# EasyEDA schematic output_charlieplex_12x11.json
TITLE: Sheet_1; REV: 1.0; Date: 2025-10-31; Sheet: 1/1; Drawn By: robdobsn; Company: Your Company
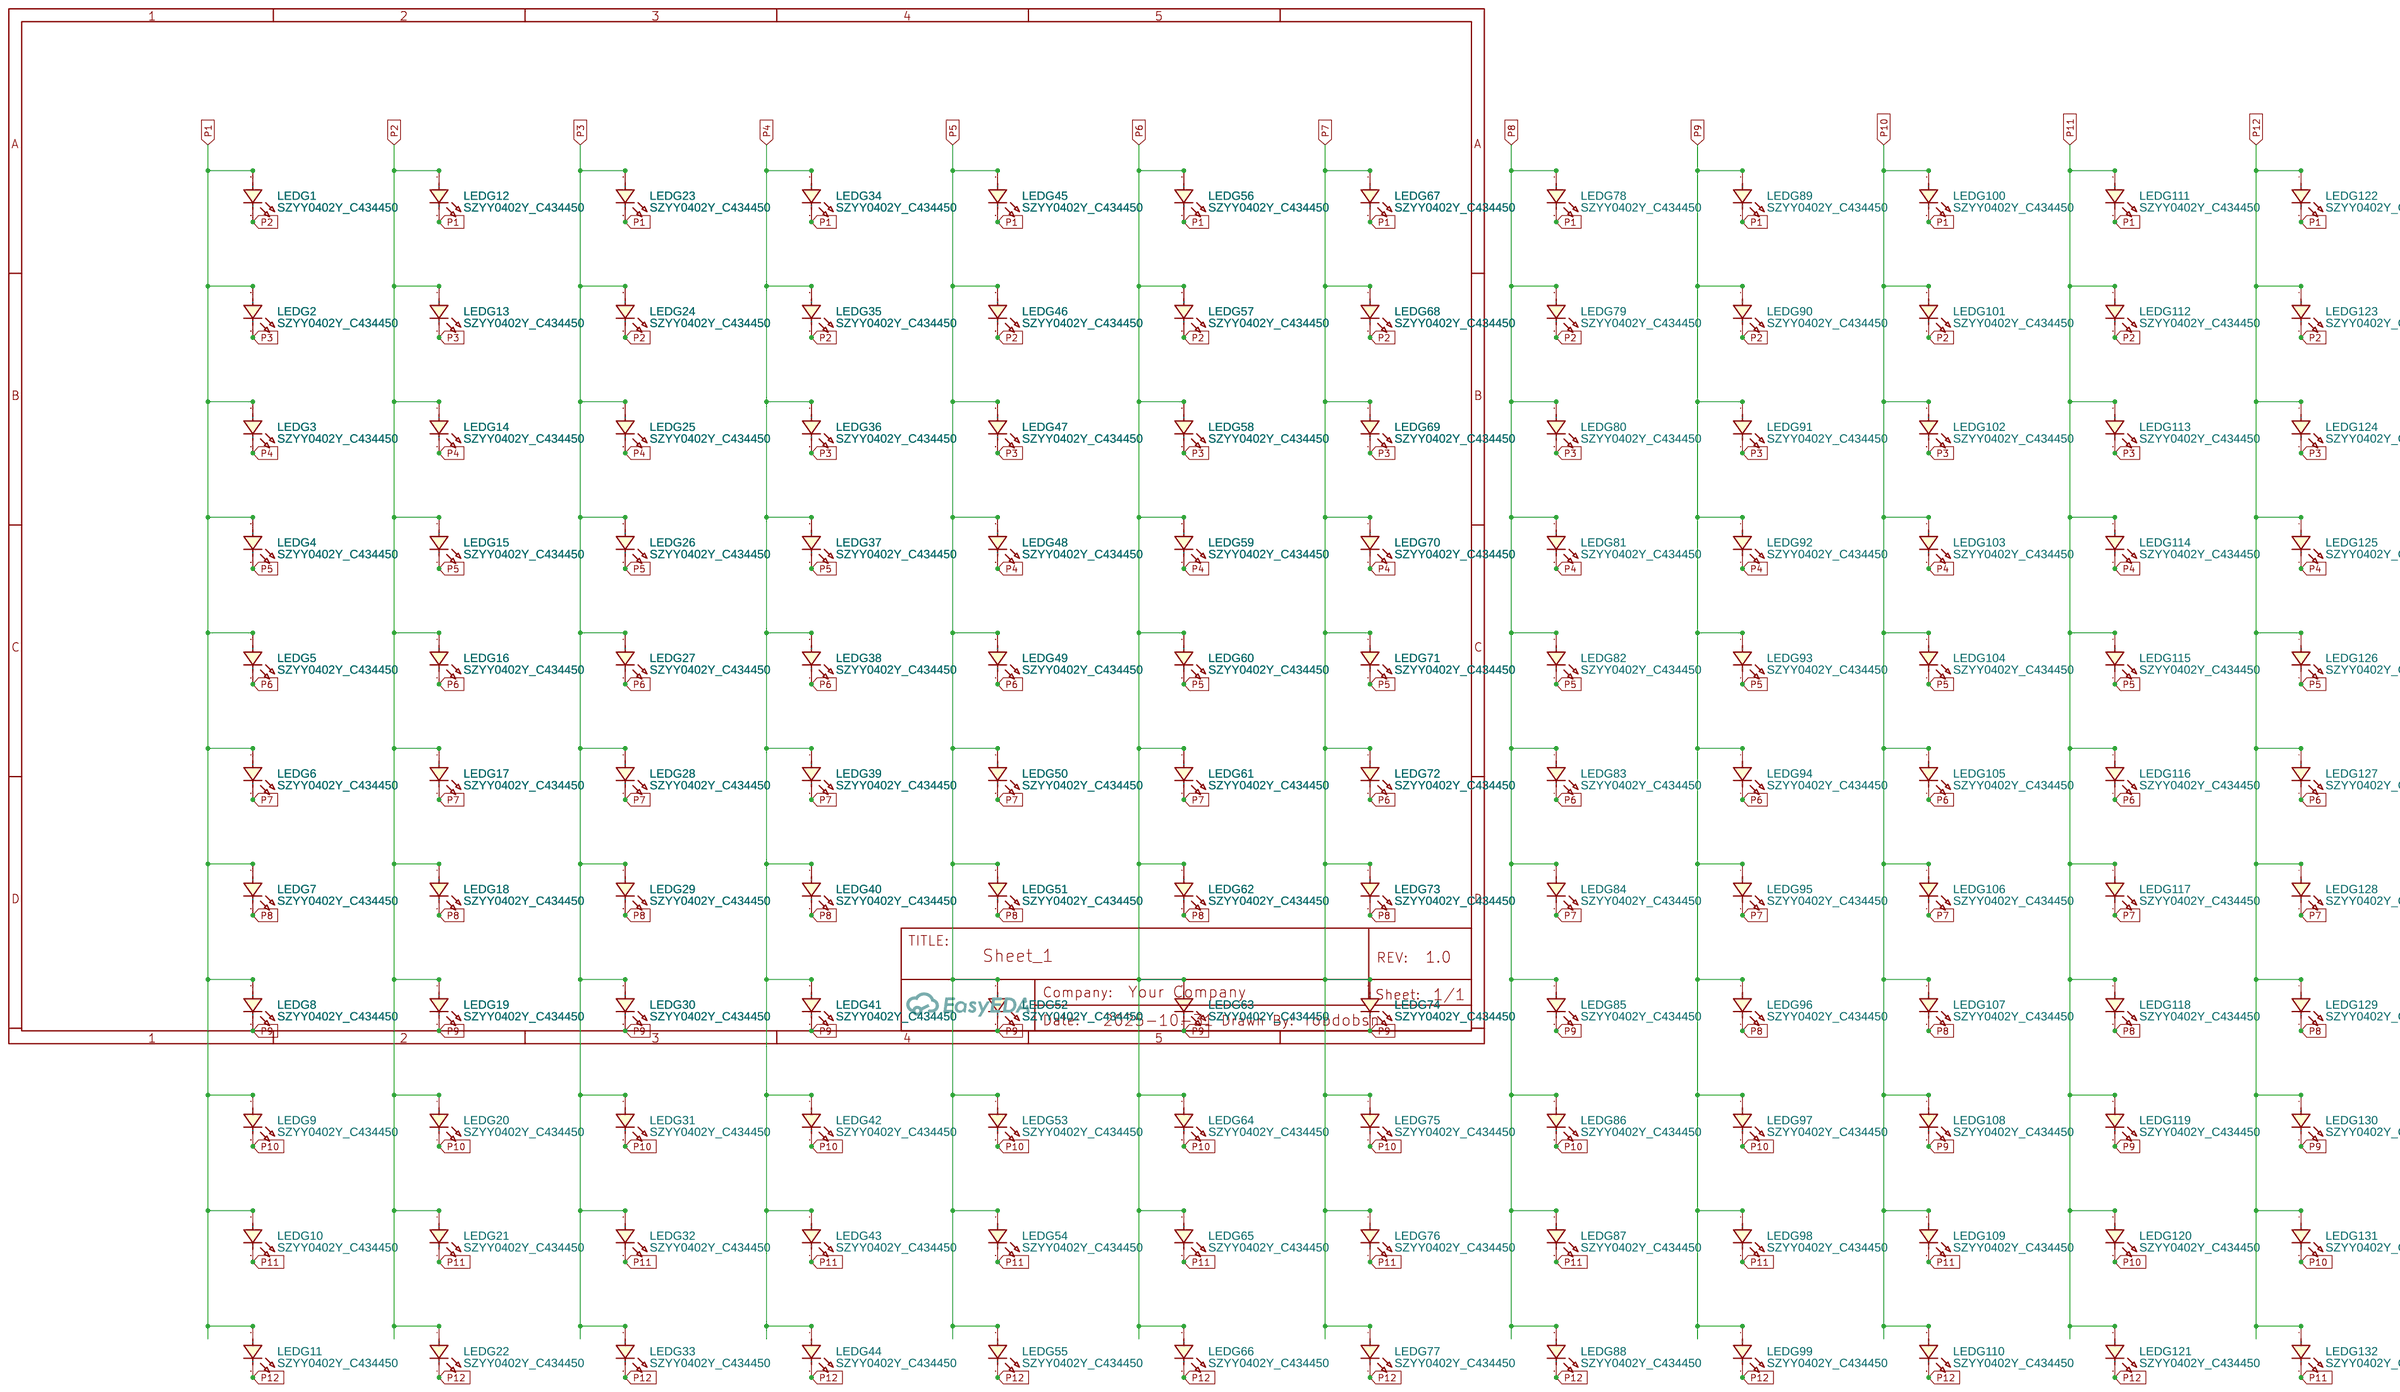
[diagram p0: schematic sheet]

## Parts
LEDG1  SZYY0402Y_C434450  [LED0402-FD_YELLOW]
LEDG2  SZYY0402Y_C434450  [LED0402-FD_YELLOW]
LEDG3  SZYY0402Y_C434450  [LED0402-FD_YELLOW]
LEDG4  SZYY0402Y_C434450  [LED0402-FD_YELLOW]
LEDG5  SZYY0402Y_C434450  [LED0402-FD_YELLOW]
LEDG6  SZYY0402Y_C434450  [LED0402-FD_YELLOW]
LEDG7  SZYY0402Y_C434450  [LED0402-FD_YELLOW]
LEDG8  SZYY0402Y_C434450  [LED0402-FD_YELLOW]
LEDG9  SZYY0402Y_C434450  [LED0402-FD_YELLOW]
LEDG10  SZYY0402Y_C434450  [LED0402-FD_YELLOW]
LEDG11  SZYY0402Y_C434450  [LED0402-FD_YELLOW]
LEDG12  SZYY0402Y_C434450  [LED0402-FD_YELLOW]
LEDG13  SZYY0402Y_C434450  [LED0402-FD_YELLOW]
LEDG14  SZYY0402Y_C434450  [LED0402-FD_YELLOW]
LEDG15  SZYY0402Y_C434450  [LED0402-FD_YELLOW]
LEDG16  SZYY0402Y_C434450  [LED0402-FD_YELLOW]
LEDG17  SZYY0402Y_C434450  [LED0402-FD_YELLOW]
LEDG18  SZYY0402Y_C434450  [LED0402-FD_YELLOW]
LEDG19  SZYY0402Y_C434450  [LED0402-FD_YELLOW]
LEDG20  SZYY0402Y_C434450  [LED0402-FD_YELLOW]
LEDG21  SZYY0402Y_C434450  [LED0402-FD_YELLOW]
LEDG22  SZYY0402Y_C434450  [LED0402-FD_YELLOW]
LEDG23  SZYY0402Y_C434450  [LED0402-FD_YELLOW]
LEDG24  SZYY0402Y_C434450  [LED0402-FD_YELLOW]
LEDG25  SZYY0402Y_C434450  [LED0402-FD_YELLOW]
LEDG26  SZYY0402Y_C434450  [LED0402-FD_YELLOW]
LEDG27  SZYY0402Y_C434450  [LED0402-FD_YELLOW]
LEDG28  SZYY0402Y_C434450  [LED0402-FD_YELLOW]
LEDG29  SZYY0402Y_C434450  [LED0402-FD_YELLOW]
LEDG30  SZYY0402Y_C434450  [LED0402-FD_YELLOW]
LEDG31  SZYY0402Y_C434450  [LED0402-FD_YELLOW]
LEDG32  SZYY0402Y_C434450  [LED0402-FD_YELLOW]
LEDG33  SZYY0402Y_C434450  [LED0402-FD_YELLOW]
LEDG34  SZYY0402Y_C434450  [LED0402-FD_YELLOW]
LEDG35  SZYY0402Y_C434450  [LED0402-FD_YELLOW]
LEDG36  SZYY0402Y_C434450  [LED0402-FD_YELLOW]
LEDG37  SZYY0402Y_C434450  [LED0402-FD_YELLOW]
LEDG38  SZYY0402Y_C434450  [LED0402-FD_YELLOW]
LEDG39  SZYY0402Y_C434450  [LED0402-FD_YELLOW]
LEDG40  SZYY0402Y_C434450  [LED0402-FD_YELLOW]
LEDG41  SZYY0402Y_C434450  [LED0402-FD_YELLOW]
LEDG42  SZYY0402Y_C434450  [LED0402-FD_YELLOW]
LEDG43  SZYY0402Y_C434450  [LED0402-FD_YELLOW]
LEDG44  SZYY0402Y_C434450  [LED0402-FD_YELLOW]
LEDG45  SZYY0402Y_C434450  [LED0402-FD_YELLOW]
LEDG46  SZYY0402Y_C434450  [LED0402-FD_YELLOW]
LEDG47  SZYY0402Y_C434450  [LED0402-FD_YELLOW]
LEDG48  SZYY0402Y_C434450  [LED0402-FD_YELLOW]
LEDG49  SZYY0402Y_C434450  [LED0402-FD_YELLOW]
LEDG50  SZYY0402Y_C434450  [LED0402-FD_YELLOW]
LEDG51  SZYY0402Y_C434450  [LED0402-FD_YELLOW]
LEDG52  SZYY0402Y_C434450  [LED0402-FD_YELLOW]
LEDG53  SZYY0402Y_C434450  [LED0402-FD_YELLOW]
LEDG54  SZYY0402Y_C434450  [LED0402-FD_YELLOW]
LEDG55  SZYY0402Y_C434450  [LED0402-FD_YELLOW]
LEDG56  SZYY0402Y_C434450  [LED0402-FD_YELLOW]
LEDG57  SZYY0402Y_C434450  [LED0402-FD_YELLOW]
LEDG58  SZYY0402Y_C434450  [LED0402-FD_YELLOW]
LEDG59  SZYY0402Y_C434450  [LED0402-FD_YELLOW]
LEDG60  SZYY0402Y_C434450  [LED0402-FD_YELLOW]
LEDG61  SZYY0402Y_C434450  [LED0402-FD_YELLOW]
LEDG62  SZYY0402Y_C434450  [LED0402-FD_YELLOW]
LEDG63  SZYY0402Y_C434450  [LED0402-FD_YELLOW]
LEDG64  SZYY0402Y_C434450  [LED0402-FD_YELLOW]
LEDG65  SZYY0402Y_C434450  [LED0402-FD_YELLOW]
LEDG66  SZYY0402Y_C434450  [LED0402-FD_YELLOW]
LEDG67  SZYY0402Y_C434450  [LED0402-FD_YELLOW]
LEDG68  SZYY0402Y_C434450  [LED0402-FD_YELLOW]
LEDG69  SZYY0402Y_C434450  [LED0402-FD_YELLOW]
LEDG70  SZYY0402Y_C434450  [LED0402-FD_YELLOW]
LEDG71  SZYY0402Y_C434450  [LED0402-FD_YELLOW]
LEDG72  SZYY0402Y_C434450  [LED0402-FD_YELLOW]
LEDG73  SZYY0402Y_C434450  [LED0402-FD_YELLOW]
LEDG74  SZYY0402Y_C434450  [LED0402-FD_YELLOW]
LEDG75  SZYY0402Y_C434450  [LED0402-FD_YELLOW]
LEDG76  SZYY0402Y_C434450  [LED0402-FD_YELLOW]
LEDG77  SZYY0402Y_C434450  [LED0402-FD_YELLOW]
LEDG78  SZYY0402Y_C434450  [LED0402-FD_YELLOW]
LEDG79  SZYY0402Y_C434450  [LED0402-FD_YELLOW]
LEDG80  SZYY0402Y_C434450  [LED0402-FD_YELLOW]
LEDG81  SZYY0402Y_C434450  [LED0402-FD_YELLOW]
LEDG82  SZYY0402Y_C434450  [LED0402-FD_YELLOW]
LEDG83  SZYY0402Y_C434450  [LED0402-FD_YELLOW]
LEDG84  SZYY0402Y_C434450  [LED0402-FD_YELLOW]
LEDG85  SZYY0402Y_C434450  [LED0402-FD_YELLOW]
LEDG86  SZYY0402Y_C434450  [LED0402-FD_YELLOW]
LEDG87  SZYY0402Y_C434450  [LED0402-FD_YELLOW]
LEDG88  SZYY0402Y_C434450  [LED0402-FD_YELLOW]
LEDG89  SZYY0402Y_C434450  [LED0402-FD_YELLOW]
LEDG90  SZYY0402Y_C434450  [LED0402-FD_YELLOW]
LEDG91  SZYY0402Y_C434450  [LED0402-FD_YELLOW]
LEDG92  SZYY0402Y_C434450  [LED0402-FD_YELLOW]
LEDG93  SZYY0402Y_C434450  [LED0402-FD_YELLOW]
LEDG94  SZYY0402Y_C434450  [LED0402-FD_YELLOW]
LEDG95  SZYY0402Y_C434450  [LED0402-FD_YELLOW]
LEDG96  SZYY0402Y_C434450  [LED0402-FD_YELLOW]
LEDG97  SZYY0402Y_C434450  [LED0402-FD_YELLOW]
LEDG98  SZYY0402Y_C434450  [LED0402-FD_YELLOW]
LEDG99  SZYY0402Y_C434450  [LED0402-FD_YELLOW]
LEDG100  SZYY0402Y_C434450  [LED0402-FD_YELLOW]
LEDG101  SZYY0402Y_C434450  [LED0402-FD_YELLOW]
LEDG102  SZYY0402Y_C434450  [LED0402-FD_YELLOW]
LEDG103  SZYY0402Y_C434450  [LED0402-FD_YELLOW]
LEDG104  SZYY0402Y_C434450  [LED0402-FD_YELLOW]
LEDG105  SZYY0402Y_C434450  [LED0402-FD_YELLOW]
LEDG106  SZYY0402Y_C434450  [LED0402-FD_YELLOW]
LEDG107  SZYY0402Y_C434450  [LED0402-FD_YELLOW]
LEDG108  SZYY0402Y_C434450  [LED0402-FD_YELLOW]
LEDG109  SZYY0402Y_C434450  [LED0402-FD_YELLOW]
LEDG110  SZYY0402Y_C434450  [LED0402-FD_YELLOW]
LEDG111  SZYY0402Y_C434450  [LED0402-FD_YELLOW]
LEDG112  SZYY0402Y_C434450  [LED0402-FD_YELLOW]
LEDG113  SZYY0402Y_C434450  [LED0402-FD_YELLOW]
LEDG114  SZYY0402Y_C434450  [LED0402-FD_YELLOW]
LEDG115  SZYY0402Y_C434450  [LED0402-FD_YELLOW]
LEDG116  SZYY0402Y_C434450  [LED0402-FD_YELLOW]
LEDG117  SZYY0402Y_C434450  [LED0402-FD_YELLOW]
LEDG118  SZYY0402Y_C434450  [LED0402-FD_YELLOW]
LEDG119  SZYY0402Y_C434450  [LED0402-FD_YELLOW]
LEDG120  SZYY0402Y_C434450  [LED0402-FD_YELLOW]
LEDG121  SZYY0402Y_C434450  [LED0402-FD_YELLOW]
LEDG122  SZYY0402Y_C434450  [LED0402-FD_YELLOW]
LEDG123  SZYY0402Y_C434450  [LED0402-FD_YELLOW]
LEDG124  SZYY0402Y_C434450  [LED0402-FD_YELLOW]
LEDG125  SZYY0402Y_C434450  [LED0402-FD_YELLOW]
LEDG126  SZYY0402Y_C434450  [LED0402-FD_YELLOW]
LEDG127  SZYY0402Y_C434450  [LED0402-FD_YELLOW]
LEDG128  SZYY0402Y_C434450  [LED0402-FD_YELLOW]
LEDG129  SZYY0402Y_C434450  [LED0402-FD_YELLOW]
LEDG130  SZYY0402Y_C434450  [LED0402-FD_YELLOW]
LEDG131  SZYY0402Y_C434450  [LED0402-FD_YELLOW]
LEDG132  SZYY0402Y_C434450  [LED0402-FD_YELLOW]

## Library data of the parts
LEDG1-LEDG132 = SZYY0402Y_C434450: Contributor: lcsc; Supplier: LCSC; Supplier Part: C434450; Manufacturer: yongyu(永裕光电); Manufacturer Part: SZYY0402Y; JLCPCB Part Class: Extended Part

## Nets
P1: LEDG1.1(A) LEDG2.1(A) LEDG3.1(A) LEDG4.1(A) LEDG5.1(A) LEDG6.1(A) LEDG7.1(A) LEDG8.1(A) LEDG9.1(A) LEDG10.1(A) LEDG11.1(A) LEDG12.2(K) LEDG23.2(K) LEDG34.2(K) LEDG45.2(K) LEDG56.2(K) LEDG67.2(K) LEDG78.2(K) LEDG89.2(K) LEDG100.2(K) LEDG111.2(K) LEDG122.2(K)
P2: LEDG1.2(K) LEDG12.1(A) LEDG13.1(A) LEDG14.1(A) LEDG15.1(A) LEDG16.1(A) LEDG17.1(A) LEDG18.1(A) LEDG19.1(A) LEDG20.1(A) LEDG21.1(A) LEDG22.1(A) LEDG24.2(K) LEDG35.2(K) LEDG46.2(K) LEDG57.2(K) LEDG68.2(K) LEDG79.2(K) LEDG90.2(K) LEDG101.2(K) LEDG112.2(K) LEDG123.2(K)
P3: LEDG2.2(K) LEDG13.2(K) LEDG23.1(A) LEDG24.1(A) LEDG25.1(A) LEDG26.1(A) LEDG27.1(A) LEDG28.1(A) LEDG29.1(A) LEDG30.1(A) LEDG31.1(A) LEDG32.1(A) LEDG33.1(A) LEDG36.2(K) LEDG47.2(K) LEDG58.2(K) LEDG69.2(K) LEDG80.2(K) LEDG91.2(K) LEDG102.2(K) LEDG113.2(K) LEDG124.2(K)
P4: LEDG3.2(K) LEDG14.2(K) LEDG25.2(K) LEDG34.1(A) LEDG35.1(A) LEDG36.1(A) LEDG37.1(A) LEDG38.1(A) LEDG39.1(A) LEDG40.1(A) LEDG41.1(A) LEDG42.1(A) LEDG43.1(A) LEDG44.1(A) LEDG48.2(K) LEDG59.2(K) LEDG70.2(K) LEDG81.2(K) LEDG92.2(K) LEDG103.2(K) LEDG114.2(K) LEDG125.2(K)
P5: LEDG4.2(K) LEDG15.2(K) LEDG26.2(K) LEDG37.2(K) LEDG45.1(A) LEDG46.1(A) LEDG47.1(A) LEDG48.1(A) LEDG49.1(A) LEDG50.1(A) LEDG51.1(A) LEDG52.1(A) LEDG53.1(A) LEDG54.1(A) LEDG55.1(A) LEDG60.2(K) LEDG71.2(K) LEDG82.2(K) LEDG93.2(K) LEDG104.2(K) LEDG115.2(K) LEDG126.2(K)
P6: LEDG5.2(K) LEDG16.2(K) LEDG27.2(K) LEDG38.2(K) LEDG49.2(K) LEDG56.1(A) LEDG57.1(A) LEDG58.1(A) LEDG59.1(A) LEDG60.1(A) LEDG61.1(A) LEDG62.1(A) LEDG63.1(A) LEDG64.1(A) LEDG65.1(A) LEDG66.1(A) LEDG72.2(K) LEDG83.2(K) LEDG94.2(K) LEDG105.2(K) LEDG116.2(K) LEDG127.2(K)
P7: LEDG6.2(K) LEDG17.2(K) LEDG28.2(K) LEDG39.2(K) LEDG50.2(K) LEDG61.2(K) LEDG67.1(A) LEDG68.1(A) LEDG69.1(A) LEDG70.1(A) LEDG71.1(A) LEDG72.1(A) LEDG73.1(A) LEDG74.1(A) LEDG75.1(A) LEDG76.1(A) LEDG77.1(A) LEDG84.2(K) LEDG95.2(K) LEDG106.2(K) LEDG117.2(K) LEDG128.2(K)
P8: LEDG7.2(K) LEDG18.2(K) LEDG29.2(K) LEDG40.2(K) LEDG51.2(K) LEDG62.2(K) LEDG73.2(K) LEDG78.1(A) LEDG79.1(A) LEDG80.1(A) LEDG81.1(A) LEDG82.1(A) LEDG83.1(A) LEDG84.1(A) LEDG85.1(A) LEDG86.1(A) LEDG87.1(A) LEDG88.1(A) LEDG96.2(K) LEDG107.2(K) LEDG118.2(K) LEDG129.2(K)
P9: LEDG8.2(K) LEDG19.2(K) LEDG30.2(K) LEDG41.2(K) LEDG52.2(K) LEDG63.2(K) LEDG74.2(K) LEDG85.2(K) LEDG89.1(A) LEDG90.1(A) LEDG91.1(A) LEDG92.1(A) LEDG93.1(A) LEDG94.1(A) LEDG95.1(A) LEDG96.1(A) LEDG97.1(A) LEDG98.1(A) LEDG99.1(A) LEDG108.2(K) LEDG119.2(K) LEDG130.2(K)
P10: LEDG9.2(K) LEDG20.2(K) LEDG31.2(K) LEDG42.2(K) LEDG53.2(K) LEDG64.2(K) LEDG75.2(K) LEDG86.2(K) LEDG97.2(K) LEDG100.1(A) LEDG101.1(A) LEDG102.1(A) LEDG103.1(A) LEDG104.1(A) LEDG105.1(A) LEDG106.1(A) LEDG107.1(A) LEDG108.1(A) LEDG109.1(A) LEDG110.1(A) LEDG120.2(K) LEDG131.2(K)
P11: LEDG10.2(K) LEDG21.2(K) LEDG32.2(K) LEDG43.2(K) LEDG54.2(K) LEDG65.2(K) LEDG76.2(K) LEDG87.2(K) LEDG98.2(K) LEDG109.2(K) LEDG111.1(A) LEDG112.1(A) LEDG113.1(A) LEDG114.1(A) LEDG115.1(A) LEDG116.1(A) LEDG117.1(A) LEDG118.1(A) LEDG119.1(A) LEDG120.1(A) LEDG121.1(A) LEDG132.2(K)
P12: LEDG11.2(K) LEDG22.2(K) LEDG33.2(K) LEDG44.2(K) LEDG55.2(K) LEDG66.2(K) LEDG77.2(K) LEDG88.2(K) LEDG99.2(K) LEDG110.2(K) LEDG121.2(K) LEDG122.1(A) LEDG123.1(A) LEDG124.1(A) LEDG125.1(A) LEDG126.1(A) LEDG127.1(A) LEDG128.1(A) LEDG129.1(A) LEDG130.1(A) LEDG131.1(A) LEDG132.1(A)
